# Altium schematic sheet RemoteControl.SchDoc: RemoteControl
size A4; CompanyName: BUPT; DrawnBy: BUPT_HCM; Engineer: BUPT_HCM; Organization: BUPT_Robot; Revision: A; SheetNumber: 1; SheetTotal: 1; Version: 1.0; LibVersion: 3.0
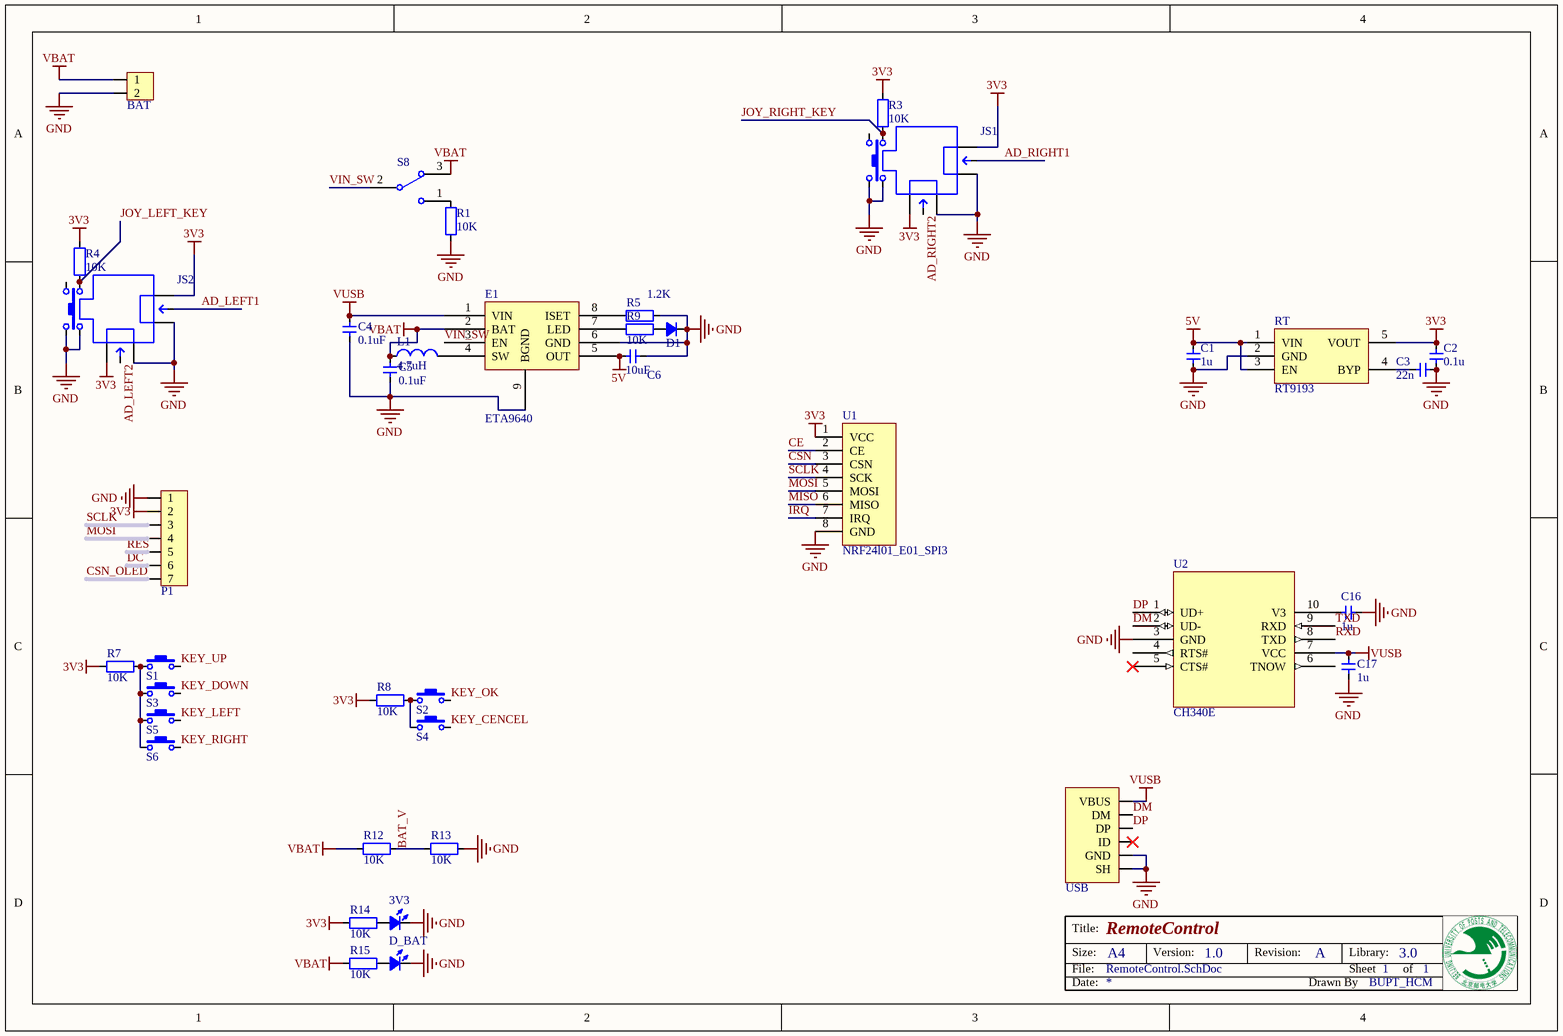
[diagram p0: RemoteControl.SchDoc]

## Parts
3V3  LED_0805  [LED_0805_RED]  (value not drawn)
BAT  HDR1x2_2.54  [HDR1X2_2.54_90]  (value not drawn)
C1  value 1u  [CAP_0603]  (hidden comment: Cap_0603)
C2  value 0.1u  [CAP_0603]  (hidden comment: Cap_0603)
C3  value 22n  [CAP_0603]  (hidden comment: Cap_0603)
C4  value 0.1uF  [CAP_0603]  (hidden comment: Cap_0603)
C5  value 0.1uF  [CAP_0603]  (hidden comment: Cap_0603)
C6  value 10uF  [CAP_0603]  (hidden comment: Cap_0603)
C16  value 1u  [CAP_0603]  (hidden comment: Cap_0603)
C17  value 1u  [CAP_0603]  (hidden comment: Cap_0603)
D1  D_0805  [LED_0805_YELLOW]  (value not drawn)
D_BAT  LED_0805  [LED_0805_RED]  (value not drawn)
E1  ETA9640  [SOP_E150_8 -with_PADs]
JS1  JoyStick  [JoyStick]  (value not drawn)
JS2  JoyStick  [JoyStick]  (value not drawn)
L1  value 4.7uH  [IND_CD32]  (hidden comment: Ind_CD32)
P1  HDR1x7_2.54  [HDR1X7_2.54_180]  (value not drawn)
R1  value 10K  [RES_0603]  (hidden comment: Res_0603)
R3  value 10K  [RES_0603]  (hidden comment: Res_0603)
R4  value 10K  [RES_0603]  (hidden comment: Res_0603)
R5  value 1.2K  [RES_0603]  (hidden comment: Res_0603)
R7  value 10K  [RES_0603]  (hidden comment: Res_0603)
R8  value 10K  [RES_0603]  (hidden comment: Res_0603)
R9  value 10K  [RES_0603]  (hidden comment: Res_0603)
R12  value 10K  [RES_0603]  (hidden comment: Res_0603)
R13  value 10K  [RES_0603]  (hidden comment: Res_0603)
R14  value 10K  [RES_0603]  (hidden comment: Res_0603)
R15  value 10K  [RES_0603]  (hidden comment: Res_0603)
RT  RT9193  [SOT23-5]
S1  ButtonTACT_3x6x2.5_180  [ButtonTACT_3x6x2.5_180]  (value not drawn)
S2  ButtonTACT_3x6x2.5_180  [ButtonTACT_3x6x2.5_180]  (value not drawn)
S3  ButtonTACT_3x6x2.5_180  [ButtonTACT_3x6x2.5_180]  (value not drawn)
S4  ButtonTACT_3x6x2.5_180  [ButtonTACT_3x6x2.5_180]  (value not drawn)
S5  ButtonTACT_3x6x2.5_180  [ButtonTACT_3x6x2.5_180]  (value not drawn)
S6  ButtonTACT_3x6x2.5_180  [ButtonTACT_3x6x2.5_180]  (value not drawn)
S8  SwitchSPDT_2.8x6.6_90  [SwitchSPDT_2.8X6.6_90]  (value not drawn)
U1  NRF24l01_E01_SPI3  [E01-ML01SP2]
U2  CH340E  [MSOP10]
USB  USB_Micro  [USB_Micro-AB]  (value not drawn)

## Nets
3V3: C2.2 JS1.1 JS1.6 JS2.1 JS2.6 P1.2 R3.2 R4.2 R7.2 R8.2 R14.1 RT.5(VOUT) U1.1(VCC)
5V: C1.2 C6.1 E1.5(OUT) RT.1(VIN) RT.3(EN)
GND: 3V3.2(K) BAT.2 C1.1 C2.1 C3.1 C4.2 C5.2 C6.2 C16.1 C17.2 D1.2(K) D_BAT.2(K) E1.6(GND) E1.9(BGND) JS1.3 JS1.4 JS1.8 JS1.10 JS2.3 JS2.4 JS2.8 JS2.10 P1.1 R1.1 R5.1 R13.1 RT.2(GND) U1.8(GND) U2.3(GND) USB.0(SH) USB.5(GND)
VBAT: BAT.1 C5.1 E1.2(BAT) L1.1 R12.2 R15.1 S8.3
VUSB: C4.1 C17.1 E1.1(VIN) U2.7(VCC) USB.1(VBUS)
AD_LEFT1: JS2.5
AD_LEFT2: JS2.2
AD_RIGHT1: JS1.5
AD_RIGHT2: JS1.2
BAT_V: R12.1 R13.2
CE: U1.2(CE)
CSN: U1.3(CSN)
CSN_OLED: P1.7
DC: P1.6
DM: U2.2(UD-) USB.2(DM)
DP: U2.1(UD+) USB.3(DP)
IRQ: U1.7(IRQ)
JOY_LEFT_KEY: JS2.9 R4.1
JOY_RIGHT_KEY: JS1.9 R3.1
KEY_CENCEL: S4.2
KEY_DOWN: S3.2
KEY_LEFT: S5.2
KEY_OK: S2.2
KEY_RIGHT: S6.2
KEY_UP: S1.2
MISO: U1.6(MISO)
MOSI: P1.4 U1.5(MOSI)
RES: P1.5
RXD: U2.8(TXD)
SCLK: P1.3 U1.4(SCK)
TXD: U2.9(RXD)
VIN_SW: E1.3(EN) S8.2
Net3V3_1: 3V3.1(A) R14.2
NetC3_2: C3.2 RT.4(BYP)
NetC16_2: C16.2 U2.10(V3)
NetD1_1: D1.1(A) R9.1
NetD_BAT_1: D_BAT.1(A) R15.2
NetE1_4: E1.4(SW) L1.2
NetE1_7: E1.7(LED) R9.2
NetE1_8: E1.8(ISET) R5.2
NetR1_2: R1.2 S8.1
NetR7_1: R7.1 S1.1 S3.1 S5.1 S6.1
NetR8_1: R8.1 S2.1 S4.1

Not connected (* = marked no-connect by the designer): JS1 7; JS2 7; U2 4(RTS#) 5(CTS#)* 6(TNOW); USB 4(ID)*

## Notes on the sheet
- Title:
- Size:
- Date:
- File:
- A4
- Version:
- Revision:
- Drawn By
- Sheet
- Library:
- of

## Library data of the parts
3V3 D_BAT = LED_0805: LED
BAT = HDR1x2_2.54: Header
C1-C6 C16 C17 = Cap_0603: Capacitor
L1 = Ind_CD32: Inductor
P1 = HDR1x7_2.54T: Header
R1 R3-R5 R7-R9 R12-R15 = Res_0603: Resistor
RT = RT9193: Power
S1-S6 = ButtonTACT_3x6x2.5_180: Button
S8 = SwitchSPDT_2.8x6.6_90: Switch
U1 = NRF24l01_E01_SPI2
U2 = CH340E: USB to TTL Serial / UART
USB = USB_Micro: USB